# Altium schematic sheet Sensor.SchDoc
size A3; SheetNumber: 4; SheetTotal: 5
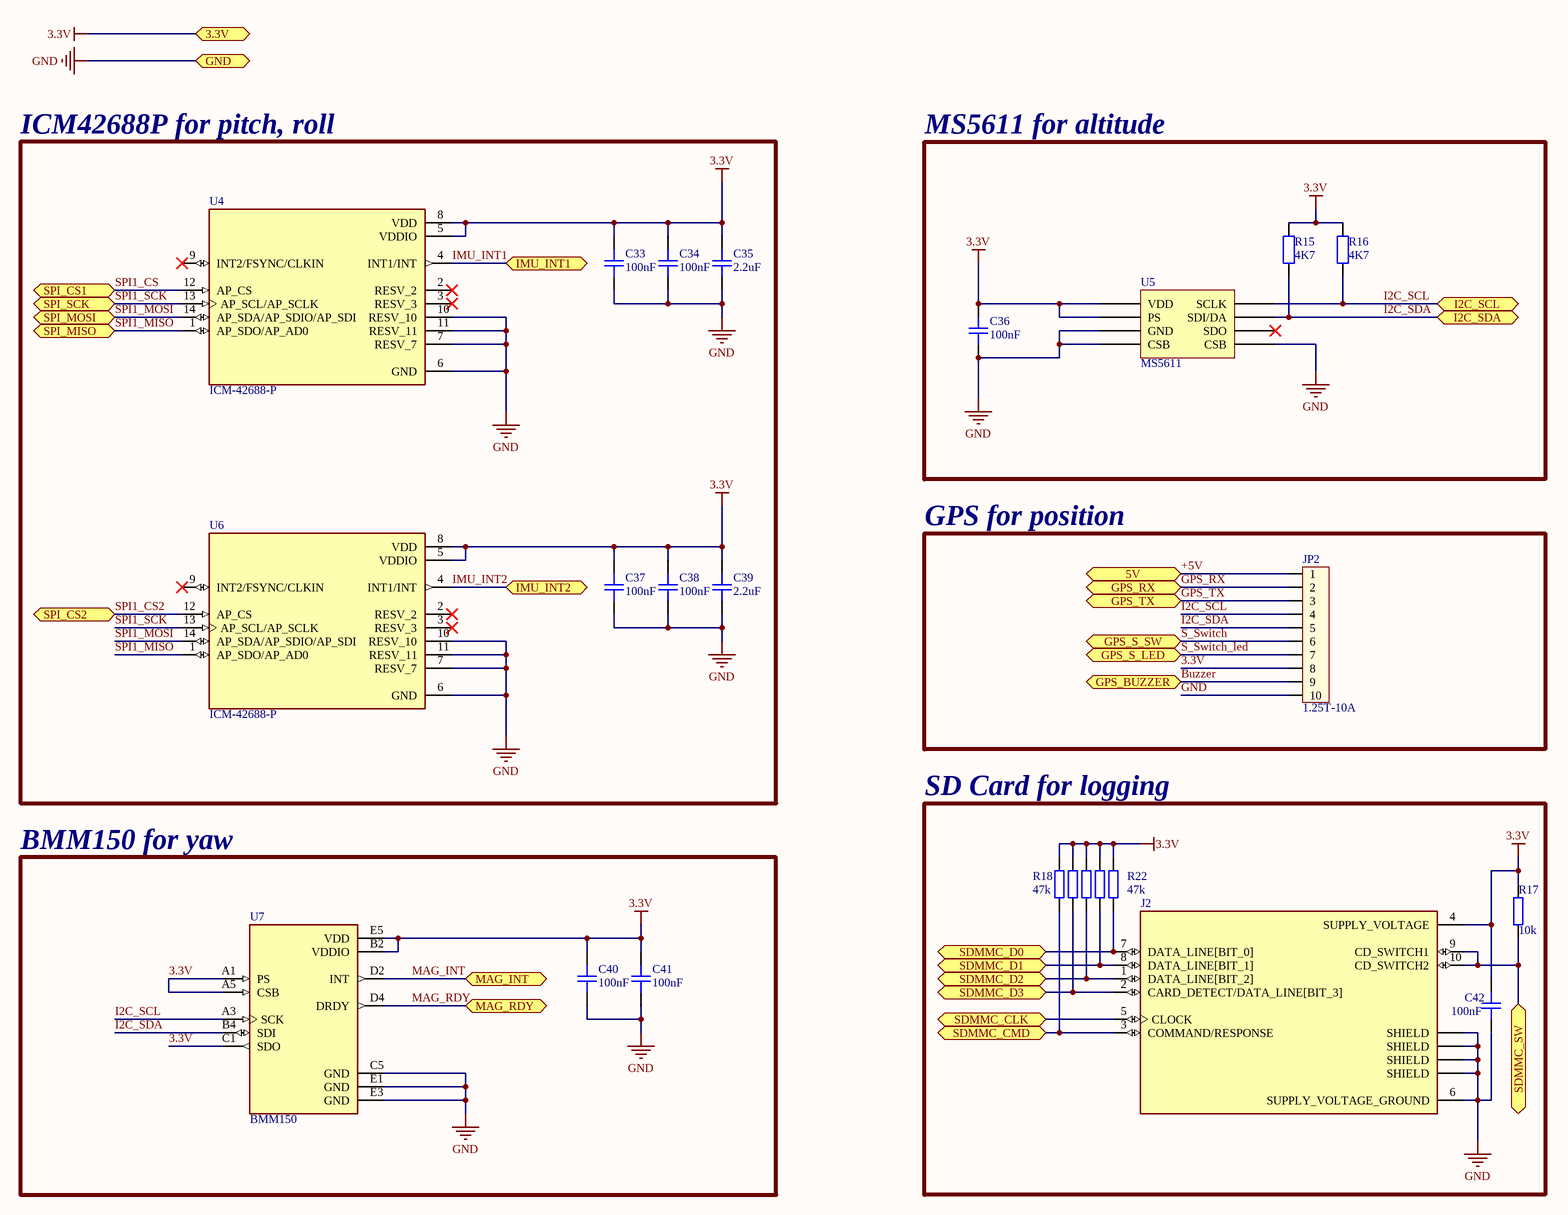
[diagram p0: Sensor.SchDoc]

## Parts
C33  100nF  [CAP_0402]
C34  100nF  [CAP_0402]
C35  2.2uF  [CAP_0603]
C36  100nF  [CAP_0402]
C37  100nF  [CAP_0402]
C38  100nF  [CAP_0402]
C39  2.2uF  [CAP_0603]
C40  100nF  [CAP_0402]
C41  100nF  [CAP_0402]
C42  100nF  [CAP_0402]
J2  (no value)  [AMPHENOL_1140084168]
JP2  1.25T-10A  [BM10B-GHS-TBT]
R15  4K7  [RESC-0402 (1005)]
R16  4K7  [RESC-0402 (1005)]
R17  10k  [RES_0402]
R18  47k  [RES_0402]
R19  47k  [RES_0402]  (value not drawn)
R20  47k  [RES_0402]  (value not drawn)
R21  47k  [RES_0402]  (value not drawn)
R22  47k  [RES_0402]
U4  ICM-42688-P  [PQFN50P300X250X97-14N]
U5  MS5611  [MS5611_1]
U6  ICM-42688-P  [PQFN50P300X250X97-14N]
U7  BMM150  [XDCR_BMM150]

## Blocks framed on the sheet
ICM42688P for pitch, roll: C33-C35 C37-C39 U4 U6
MS5611 for altitude: C36 R15 R16 U5
GPS for position: JP2
SD Card for logging: C42 J2 R17-R22
BMM150 for yaw: C40 C41 U7

## Ports
3.3V (bidir), 5V (bidir), GND (bidir), GPS_BUZZER (bidir), GPS_RX (bidir), GPS_S_LED (bidir), GPS_S_SW (bidir), GPS_TX (bidir), I2C_SCL (bidir), I2C_SDA (bidir), IMU_INT1 (bidir), IMU_INT2 (bidir), MAG_INT (bidir), MAG_RDY (bidir), SDMMC_CLK (bidir), SDMMC_CMD (bidir), SDMMC_D0 (bidir), SDMMC_D1 (bidir), SDMMC_D2 (bidir), SDMMC_D3 (bidir), SDMMC_SW (bidir), SPI_CS1 (bidir), SPI_CS2 (bidir), SPI_MISO (bidir), SPI_MOSI (bidir), SPI_SCK (bidir)

## Nets
3.3V: C33.2 C34.2 C35.2 C36.2 C37.2 C38.2 C39.2 C40.2 C41.2 C42.2 J2.4(SUPPLY_VOLTAGE) JP2.8 R15.2 R16.2 R17.2 R18.2 R19.2 R20.2 R21.2 R22.2 U4.5(VDDIO) U4.8(VDD) U5.128(VDD) U5.129(PS) U6.5(VDDIO) U6.8(VDD) U7.A1(PS) U7.A5(CSB) U7.B2(VDDIO) U7.C1(SDO) U7.E5(VDD) ; port 3.3V
GND: C33.1 C34.1 C35.1 C36.1 C37.1 C38.1 C39.1 C40.1 C41.1 C42.1 J2.6(SUPPLY_VOLTAGE_GROUND) J2.S1(SHIELD) J2.S2(SHIELD) J2.S3(SHIELD) J2.S4(SHIELD) JP2.10 U4.6(GND) U4.7(RESV_7) U4.10(RESV_10) U4.11(RESV_11) U5.130(GND) U5.131(CSB) U5.132(CSB) U6.6(GND) U6.7(RESV_7) U6.10(RESV_10) U6.11(RESV_11) U7.C5(GND) U7.E1(GND) U7.E3(GND) ; port GND
+5V: JP2.1 ; port 5V
Buzzer: JP2.9 ; port GPS_BUZZER
GPS_RX: JP2.2 ; port GPS_RX
GPS_TX: JP2.3 ; port GPS_TX
I2C_SCL: JP2.4 R16.1 U5.135(SCLK) U7.A3(SCK) ; port I2C_SCL
I2C_SDA: JP2.5 R15.1 U5.134(SDI/DA) U7.B4(SDI) ; port I2C_SDA
IMU_INT1: U4.4(INT1/INT) ; port IMU_INT1
IMU_INT2: U6.4(INT1/INT) ; port IMU_INT2
MAG_INT: U7.D2(INT) ; port MAG_INT
MAG_RDY: U7.D4(DRDY) ; port MAG_RDY
S_Switch: JP2.6 ; port GPS_S_SW
S_Switch_led: JP2.7 ; port GPS_S_LED
SDMMC_CLK: J2.5(CLOCK) ; port SDMMC_CLK
SDMMC_CMD: J2.3(COMMAND/RESPONSE) R18.1 ; port SDMMC_CMD
SDMMC_D0: J2.7(DATA_LINE[BIT_0]) R22.1 ; port SDMMC_D0
SDMMC_D1: J2.8(DATA_LINE[BIT_1]) R21.1 ; port SDMMC_D1
SDMMC_D2: J2.1(DATA_LINE[BIT_2]) R20.1 ; port SDMMC_D2
SDMMC_D3: J2.2(CARD_DETECT/DATA_LINE[BIT_3]) R19.1 ; port SDMMC_D3
SDMMC_SW: J2.9(CD_SWITCH1) J2.10(CD_SWITCH2) R17.1 ; port SDMMC_SW
SPI1_CS: U4.12(AP_CS) ; port SPI_CS1
SPI1_CS2: U6.12(AP_CS) ; port SPI_CS2
SPI1_MISO: U4.1(AP_SDO/AP_AD0) U6.1(AP_SDO/AP_AD0) ; port SPI_MISO
SPI1_MOSI: U4.14(AP_SDA/AP_SDIO/AP_SDI) U6.14(AP_SDA/AP_SDIO/AP_SDI) ; port SPI_MOSI
SPI1_SCK: U4.13(AP_SCL/AP_SCLK) U6.13(AP_SCL/AP_SCLK) ; port SPI_SCK

Not connected (* = marked no-connect by the designer): U4 2(RESV_2)* 3(RESV_3)* 9(INT2/FSYNC/CLKIN)*; U5 133(SDO)*; U6 2(RESV_2)* 3(RESV_3)* 9(INT2/FSYNC/CLKIN)*

## Library data of the parts
C33 C34 C36-C38 C40-C42 = CAP_0402: 0402 100nF 16V X7R; Manufacturer: *; Manufacturer Part Number: *; Distributor Link: *; LCSC: *; Rating: *; Dielectric: *
C35 C39 = CAP_0603: 0603 2.2uF 10V X7R; Manufacturer: *; Manufacturer Part Number: *; Distributor Link: *; LCSC: *; Rating: *; Dielectric: *
J2 = 1140084168: MEMORY CARD CONNECTOR, MICROSD, 8 POSITION, FULL REEL; Memory / Card Type:MicroSD; Insert & Eject Mechanism:Push-Pull; No. of Contacts:8Contacts; Contact Material:Copper Alloy; Contact Plating:Gold Plated Contacts; Product Range:- RoHS Compliant: Yes; MF: amphenol communications solutions; MP: 114-00841-68..; SnapEDA_Link: https://www.snapeda.com/parts/114-00841-68../Amphenol/view-part/?ref=snap; Package: None; Value: *; Check_prices: https://www.snapeda.com/parts/114-00841-68../Amphenol/view-part/?ref=eda
JP2 = Header 1_2.54_10P: Cắm; Don_Vi: Con; Chung_Loai: Cắm
R15 R16 = RC0603FR-074K7L: RES SMD 4.7K OHM 1% 1/10W 0603; CompanyID: VT-00327; Solder: SMT; MPN: RC0603FR-074K7L; Value: 4K7; Category: RESISTOR
R17-R22 = RES_0402: Resistor SMD 0402; Manufacturer: *; Manufacturer Part Number: *; Distributor Link: *; LCSC: *
U4 U6 = ICM-42688-P: Accelerometer, Gyroscope, 6 Axis Sensor Output; Package: None; MP: ICM-42688-P; Value: *; Availability: Unavailable; Price: None
U5 = MS5611: pin to pad: 128>1 129>2 130>3 131>4 132>5 133>6 134>7 135>8
U7 = BMM150: FlipCore, Hall Effect Sensor X, Y, Z Axis 12-WLCSP (1.56x1.56); MF: Bosch Sensortec; SnapEDA_Link: https://www.snapeda.com/parts/BMM150/Bosch/view-part/?ref=snap; Package: WLCSP-12 Bosch; Value: *; MP: BMM150; Check_prices: https://www.snapeda.com/parts/BMM150/Bosch/view-part/?ref=eda